# EAGLE design LICL_Diff (EAGLE 9.2.1)
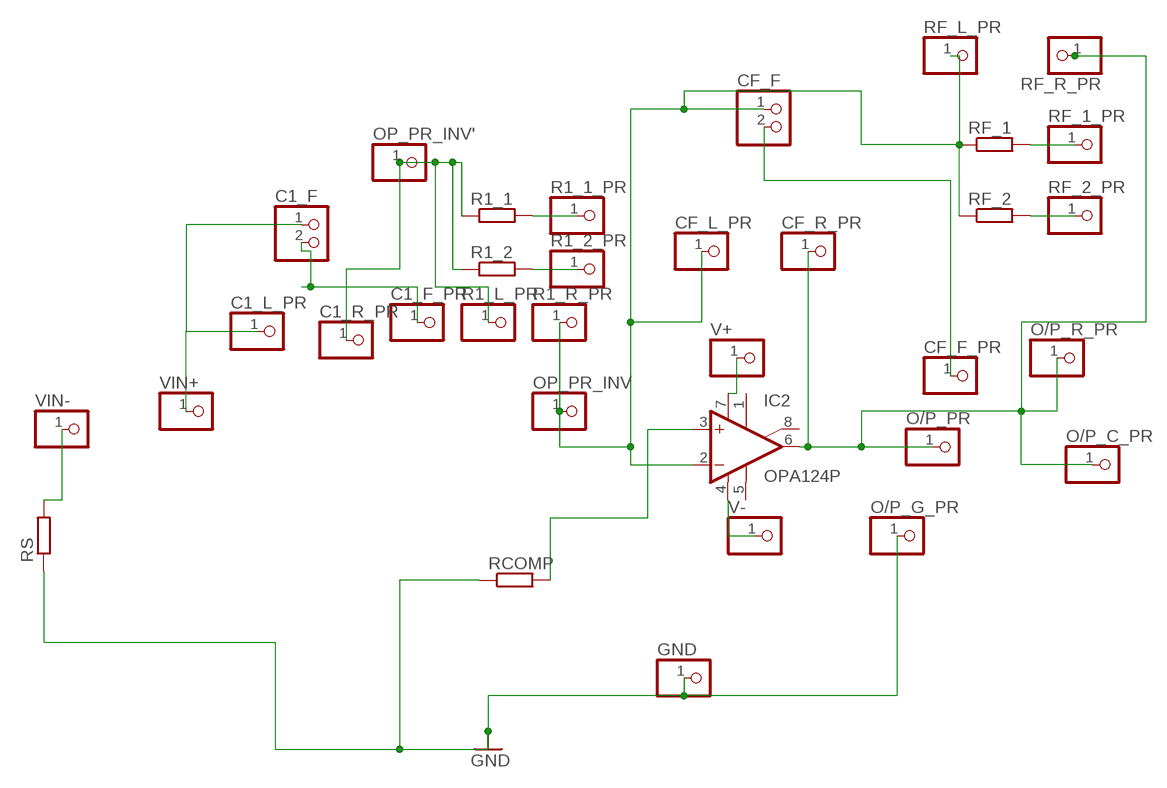
[diagram p0: schematic, sheet 1]

## Parts
C1_F  PINHD-1X2  [1X02]
C1_F_PR  PINHD-1X1  [1X01]
C1_L_PR  PINHD-1X1  [1X01]
C1_R_PR  PINHD-1X1  [1X01]
CF_F  PINHD-1X2  [1X02]
CF_F_PR  PINHD-1X1  [1X01]
CF_L_PR  PINHD-1X1  [1X01]
CF_R_PR  PINHD-1X1  [1X01]
GND  PINHD-1X1  [1X01]
IC2  OPA124P  [DIL08]
O/P_C_PR  PINHD-1X1  [1X01]
O/P_G_PR  PINHD-1X1  [1X01]
O/P_PR  PINHD-1X1  [1X01]
O/P_R_PR  PINHD-1X1  [1X01]
OP_PR_INV  PINHD-1X1  [1X01]
OP_PR_INV'  PINHD-1X1  [1X01]
R1_1  R-EU_0207/10  [0207/10]
R1_1_PR  PINHD-1X1  [1X01]
R1_2  R-EU_0207/10  [0207/10]
R1_2_PR  PINHD-1X1  [1X01]
R1_L_PR  PINHD-1X1  [1X01]
R1_R_PR  PINHD-1X1  [1X01]
RCOMP  R-EU_0207/10  [0207/10]
RF_1  R-EU_0207/10  [0207/10]
RF_1_PR  PINHD-1X1  [1X01]
RF_2  R-EU_0207/10  [0207/10]
RF_2_PR  PINHD-1X1  [1X01]
RF_L_PR  PINHD-1X1  [1X01]
RF_R_PR  PINHD-1X1  [1X01]
RS  R-EU_0207/10  [0207/10]
V+  PINHD-1X1  [1X01]
V-  PINHD-1X1  [1X01]
VIN+  PINHD-1X1  [1X01]
VIN-  PINHD-1X1  [1X01]

## Nets
GND: GND.1 O/P_G_PR.1 RCOMP.1 RS.1
N$1: CF_R_PR.1 IC2.6(OUT) O/P_C_PR.1 O/P_PR.1 O/P_R_PR.1 RF_R_PR.1
N$2: CF_F.1 CF_L_PR.1 IC2.2(-IN) OP_PR_INV.1 R1_R_PR.1 RF_1.1 RF_2.1 RF_L_PR.1
N$3: IC2.3(+IN) RCOMP.2
N$4: IC2.4(V-) V-.1
N$5: IC2.7(V+) V+.1
N$6: R1_1.2 R1_1_PR.1
N$7: CF_F.2 CF_F_PR.1
N$8: RF_1.2 RF_1_PR.1
N$9: RF_2.2 RF_2_PR.1
N$10: R1_2.2 R1_2_PR.1
N$11: C1_F.1 C1_L_PR.1 VIN+.1
N$12: C1_R_PR.1 OP_PR_INV'.1 R1_1.1 R1_2.1 R1_L_PR.1
N$13: C1_F.2 C1_F_PR.1
N$14: RS.2 VIN-.1
Unconnected: IC2.1(TRIM1) IC2.5(TRIM2) IC2.8(SUBS)

## Library data of the parts
C1_F CF_F = pinhead:PINHD-1X2: PIN HEADER
C1_F_PR C1_L_PR C1_R_PR CF_F_PR CF_L_PR CF_R_PR GND O/P_C_PR O/P_G_PR O/P_PR O/P_R_PR OP_PR_INV OP_PR_INV' R1_1_PR R1_2_PR R1_L_PR R1_R_PR RF_1_PR RF_2_PR RF_L_PR RF_R_PR V+ V- VIN+ VIN- = pinhead:PINHD-1X1: PIN HEADER
IC2 = burr-brown:OPA124: Difet Operational Amplifier Low Noise, Precision; OC_FARNELL: unknown; OC_NEWARK: unknown
R1_1 R1_2 RCOMP RF_1 RF_2 RS = resistor:R-EU_: RESISTOR, European symbol

## Board
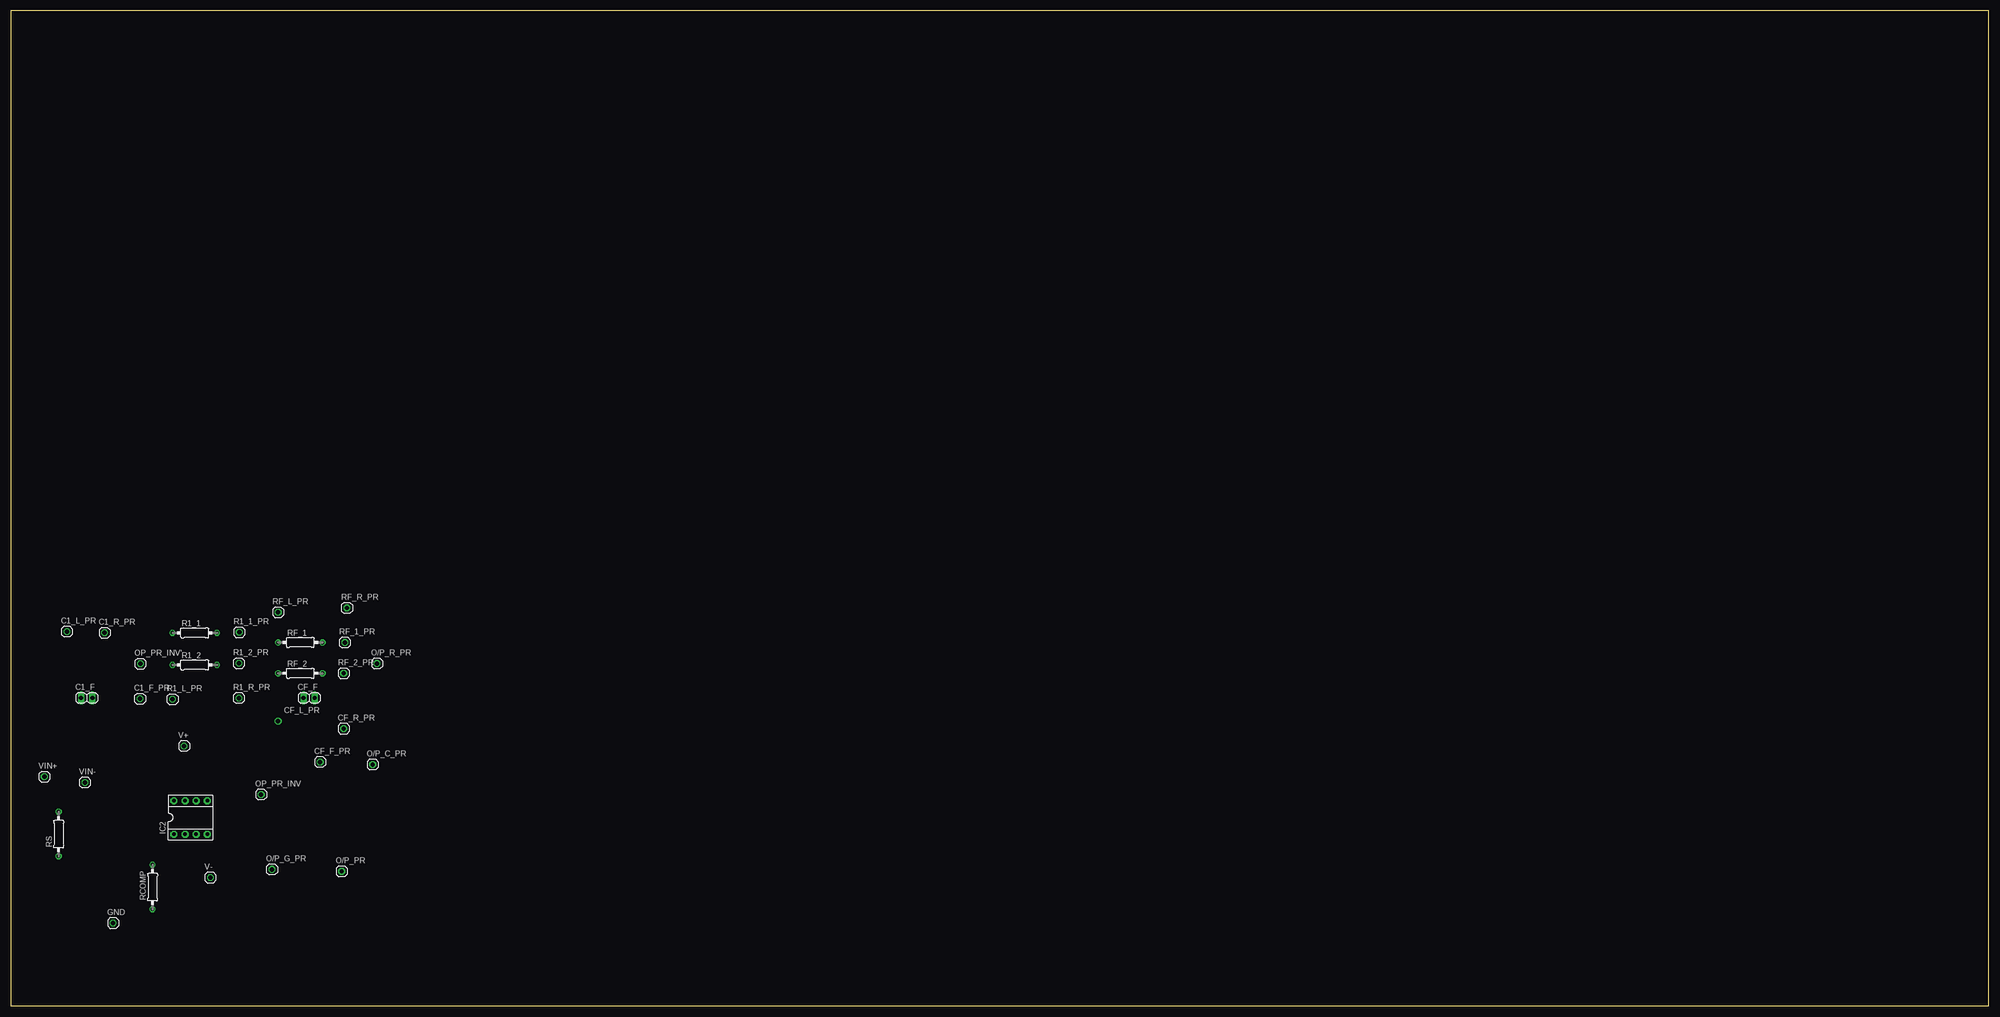
[diagram p1: board, top side]
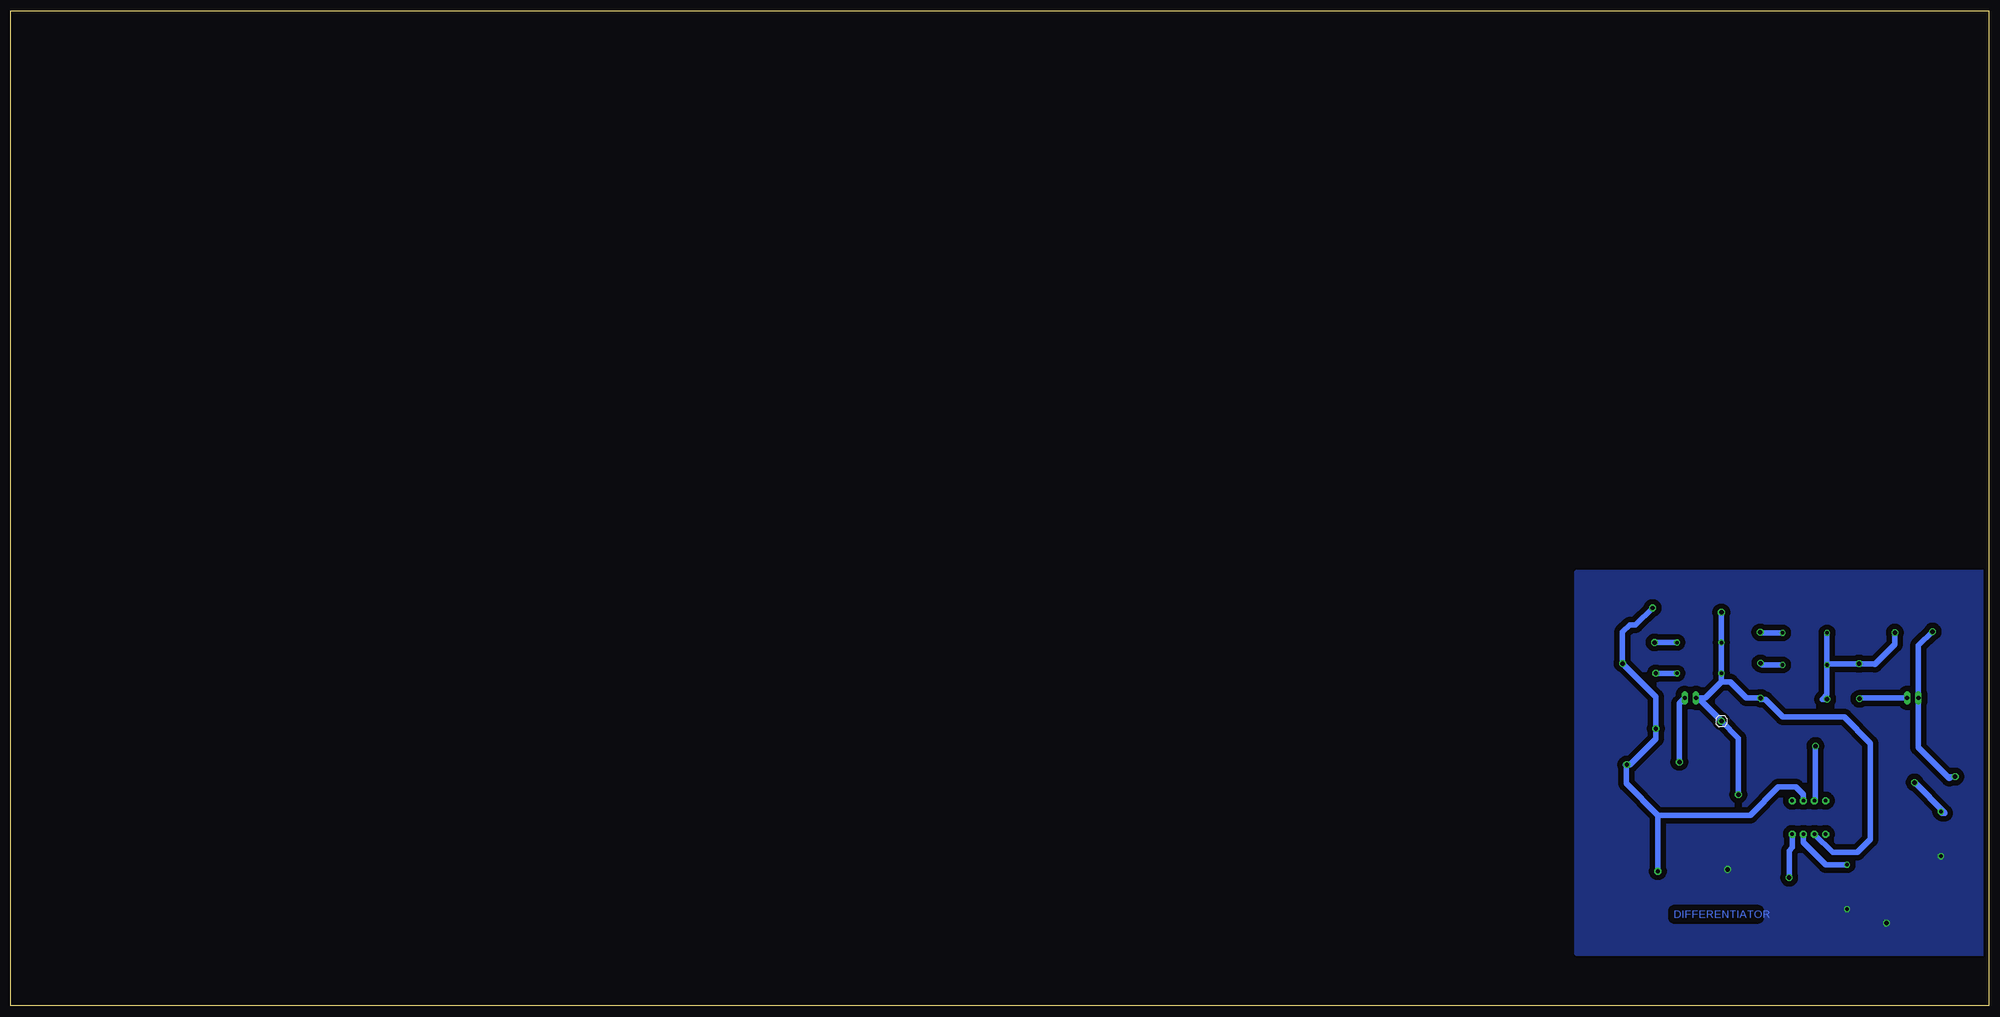
[diagram p2: board, bottom side, seen from below]

Size 451.79 x 227.32 mm. Coordinates in mm from the lower left corner, seen from the top.
Outline: 0,0 451.79,0 451.79,227.32 0,227.32 0,0
Copper layers (1*16): Top 0.035mm / dielectric 1.5mm / Bottom 0.035mm
Design rules "default": minimum track width 6mil, minimum drill 0.35mm, track to track 6mil, track to pad 6mil, pad to pad 6mil, via to via 6mil, smd to smd 6mil, copper to edge 40mil, drill to drill 6mil, minimum pad ring 10mil, minimum via ring 8mil, stop-mask expansion 4mil, vias tented up to drill 0mil, thermal gap 10mil

### Footprints (pad centres in the part's own frame; a part is rotated, then mirrored left to right if it is on the bottom)
1X02 = drill 1.016 long: 1 -1.27,0; 2 1.27,0
1X01 = drill 1.016 octagon: 1 0,0
DIL08 = drill 0.813 pad 1.6 octagon: 1 -3.81,-3.81; 2 -1.27,-3.81; 3 1.27,-3.81; 4 3.81,-3.81; 5 3.81,3.81; 6 1.27,3.81; 7 -1.27,3.81; 8 -3.81,3.81
0207/10 = drill 0.813 octagon: 1 -5.08,0; 2 5.08,0

### Placement (x,y rotation side)
C1_F  17.32,70.34 0 top
C1_F_PR  29.48,70.15 0 top
C1_L_PR  12.78,85.5 0 top
C1_R_PR  21.4,85.23 0 top
CF_F  68.12,70.34 0 top
CF_F_PR  70.63,55.69 0 top
CF_L_PR  61.04,65.04 0 bottom
CF_R_PR  76.01,63.31 0 top
GND  23.34,18.89 0 top
IC2  41.04,43.02 0 top
O/P_C_PR  82.63,55.13 0 top
O/P_G_PR  59.63,31.16 0 top
O/P_PR  75.55,30.72 0 top
O/P_R_PR  83.63,78.21 0 top
OP_PR_INV  57.15,48.26 0 top
OP_PR_INV'  29.56,78.15 0 top
R1_1  41.99,85.2 0 top
R1_1_PR  52.15,85.34 0 top
R1_2  41.99,77.88 0 top
R1_2_PR  52.07,78.26 0 top
R1_L_PR  36.91,70.04 0 top
R1_R_PR  52.07,70.31 0 top
RCOMP  32.34,27.13 90 top
RF_1  66.12,83.01 0 top
RF_1_PR  76.28,83.01 0 top
RF_2  66.12,75.96 0 top
RF_2_PR  76.01,75.96 0 top
RF_L_PR  61.04,89.9 0 top
RF_R_PR  76.74,90.9 0 top
RS  10.89,39.24 90 top
V+  39.55,59.34 0 top
V-  45.55,29.29 0 top
VIN+  7.62,52.34 0 top
VIN-  16.89,51.02 0 top

### Tracks (layer width: path | path; a pad name or v marks a point on that pad's centre or on a via)
GND
  pour Bottom (isolate 1.27): 0,12 0,99 94,99 94,12
N$1
  Bottom 1.27: RF_R_PR.1 80.64,87 82,87 83.63,85.37 O/P_R_PR.1 76.01,70.59 CF_R_PR.1 76.01,61.01 76,61 82,55 82.76,55 | 83,55 82.76,55 | 82.76,55 O/P_C_PR.1 | O/P_PR.1 75.55,43.55 | 82.76,55 82.76,50.76 75.55,43.55 | IC2.6 42.31,48.31 44,50 48,50 54.45,43.55 75.55,43.55
N$2
  Bottom 1.27: RF_L_PR.1 RF_1.1 RF_2.1 61.04,73.96 | 61.04,73.96 64.66,70.34 CF_F.1 67,70.19 67,70 66,70 CF_L_PR.1 57.15,61.15 OP_PR_INV.1 | 61.04,73.96 58.96,73.96 55.31,70.31 R1_R_PR.1 52.07,70.07 52,70 51,70 47,66 33,66 27,60 27,38 30,35 35.56,35 IC2.2
N$3
  Bottom 1.27: RCOMP.2 37.21,32.21 42.31,37.31 IC2.3
N$4
  Bottom 1.27: V-.1 45.55,35.45 44.85,36.15 IC2.4
N$5
  Bottom 1.27: V+.1 39.55,47.05 IC2.7
N$6
  Bottom 1.27: R1_1.2 52.01,85.2 R1_1_PR.1
N$7
  Bottom 1.27: CF_F.2 70.63,69.1 CF_F_PR.1
N$8
  Bottom 1.27: RF_1.2 RF_1_PR.1
N$9
  Bottom 1.27: RF_2.2 RF_2_PR.1
N$10
  Bottom 1.27: R1_2.2 51.69,77.88 R1_2_PR.1
N$11
  Bottom 1.27: VIN+.1 8.66,52.34 9,52 16.05,59.05 C1_F.1 16,70.29 | C1_L_PR.1 16,82.28 16,70.29 | 16,70 16,70.29
N$12
  Bottom 1.27: 36.64,78.15 OP_PR_INV'.1 26.15,78.15 26,78 21.4,82.6 C1_R_PR.1 | 36.64,78.15 R1_2.1 36.91,71.09 38,70 36.95,70 R1_L_PR.1 | R1_1.1 36.91,78.42 36.64,78.15
N$13
  Bottom 1.27: C1_F.2 29.29,70.34 C1_F_PR.1
N$14
  Bottom 1.27: VIN-.1 10,44.13 10,44 10.57,44 RS.2

### Text on the board
Bottom: DIFFERENTIATOR